# Altium project DM3370.PrjPcb (part 4 of 14)

## Sheet DM3370_LCD_LEDring.SchDoc: =project_title
size Tabloid; PageSetup: Record=PageOptions|CenterHorizontal=True|CenterVertical=True|PrintScale=0.71|XCorrection=1.00|YCorrection=1.00|PrintKind=0|BorderSize=5000000|LeftOffset=0|BottomOffset=0|Orientation=2|PaperLength=1000|PaperWidth=1000|Scale=100|PaperSource=7|PrintQuality=-4|MediaType=1|DitherType=10|PrintScaleMode=1|PaperKind=A4; CompanyName: Luxonis Holding; DrawnBy: David Malovrh; Organization: Luxonis Holding; Address1: 1925 Harmony Park Drive; Address2: Westminster, CO; Address3: 80234; Address4: United States; DocumentNumber: 11; Revision: R5M2E5; SheetNumber: 11; SheetTotal: 17
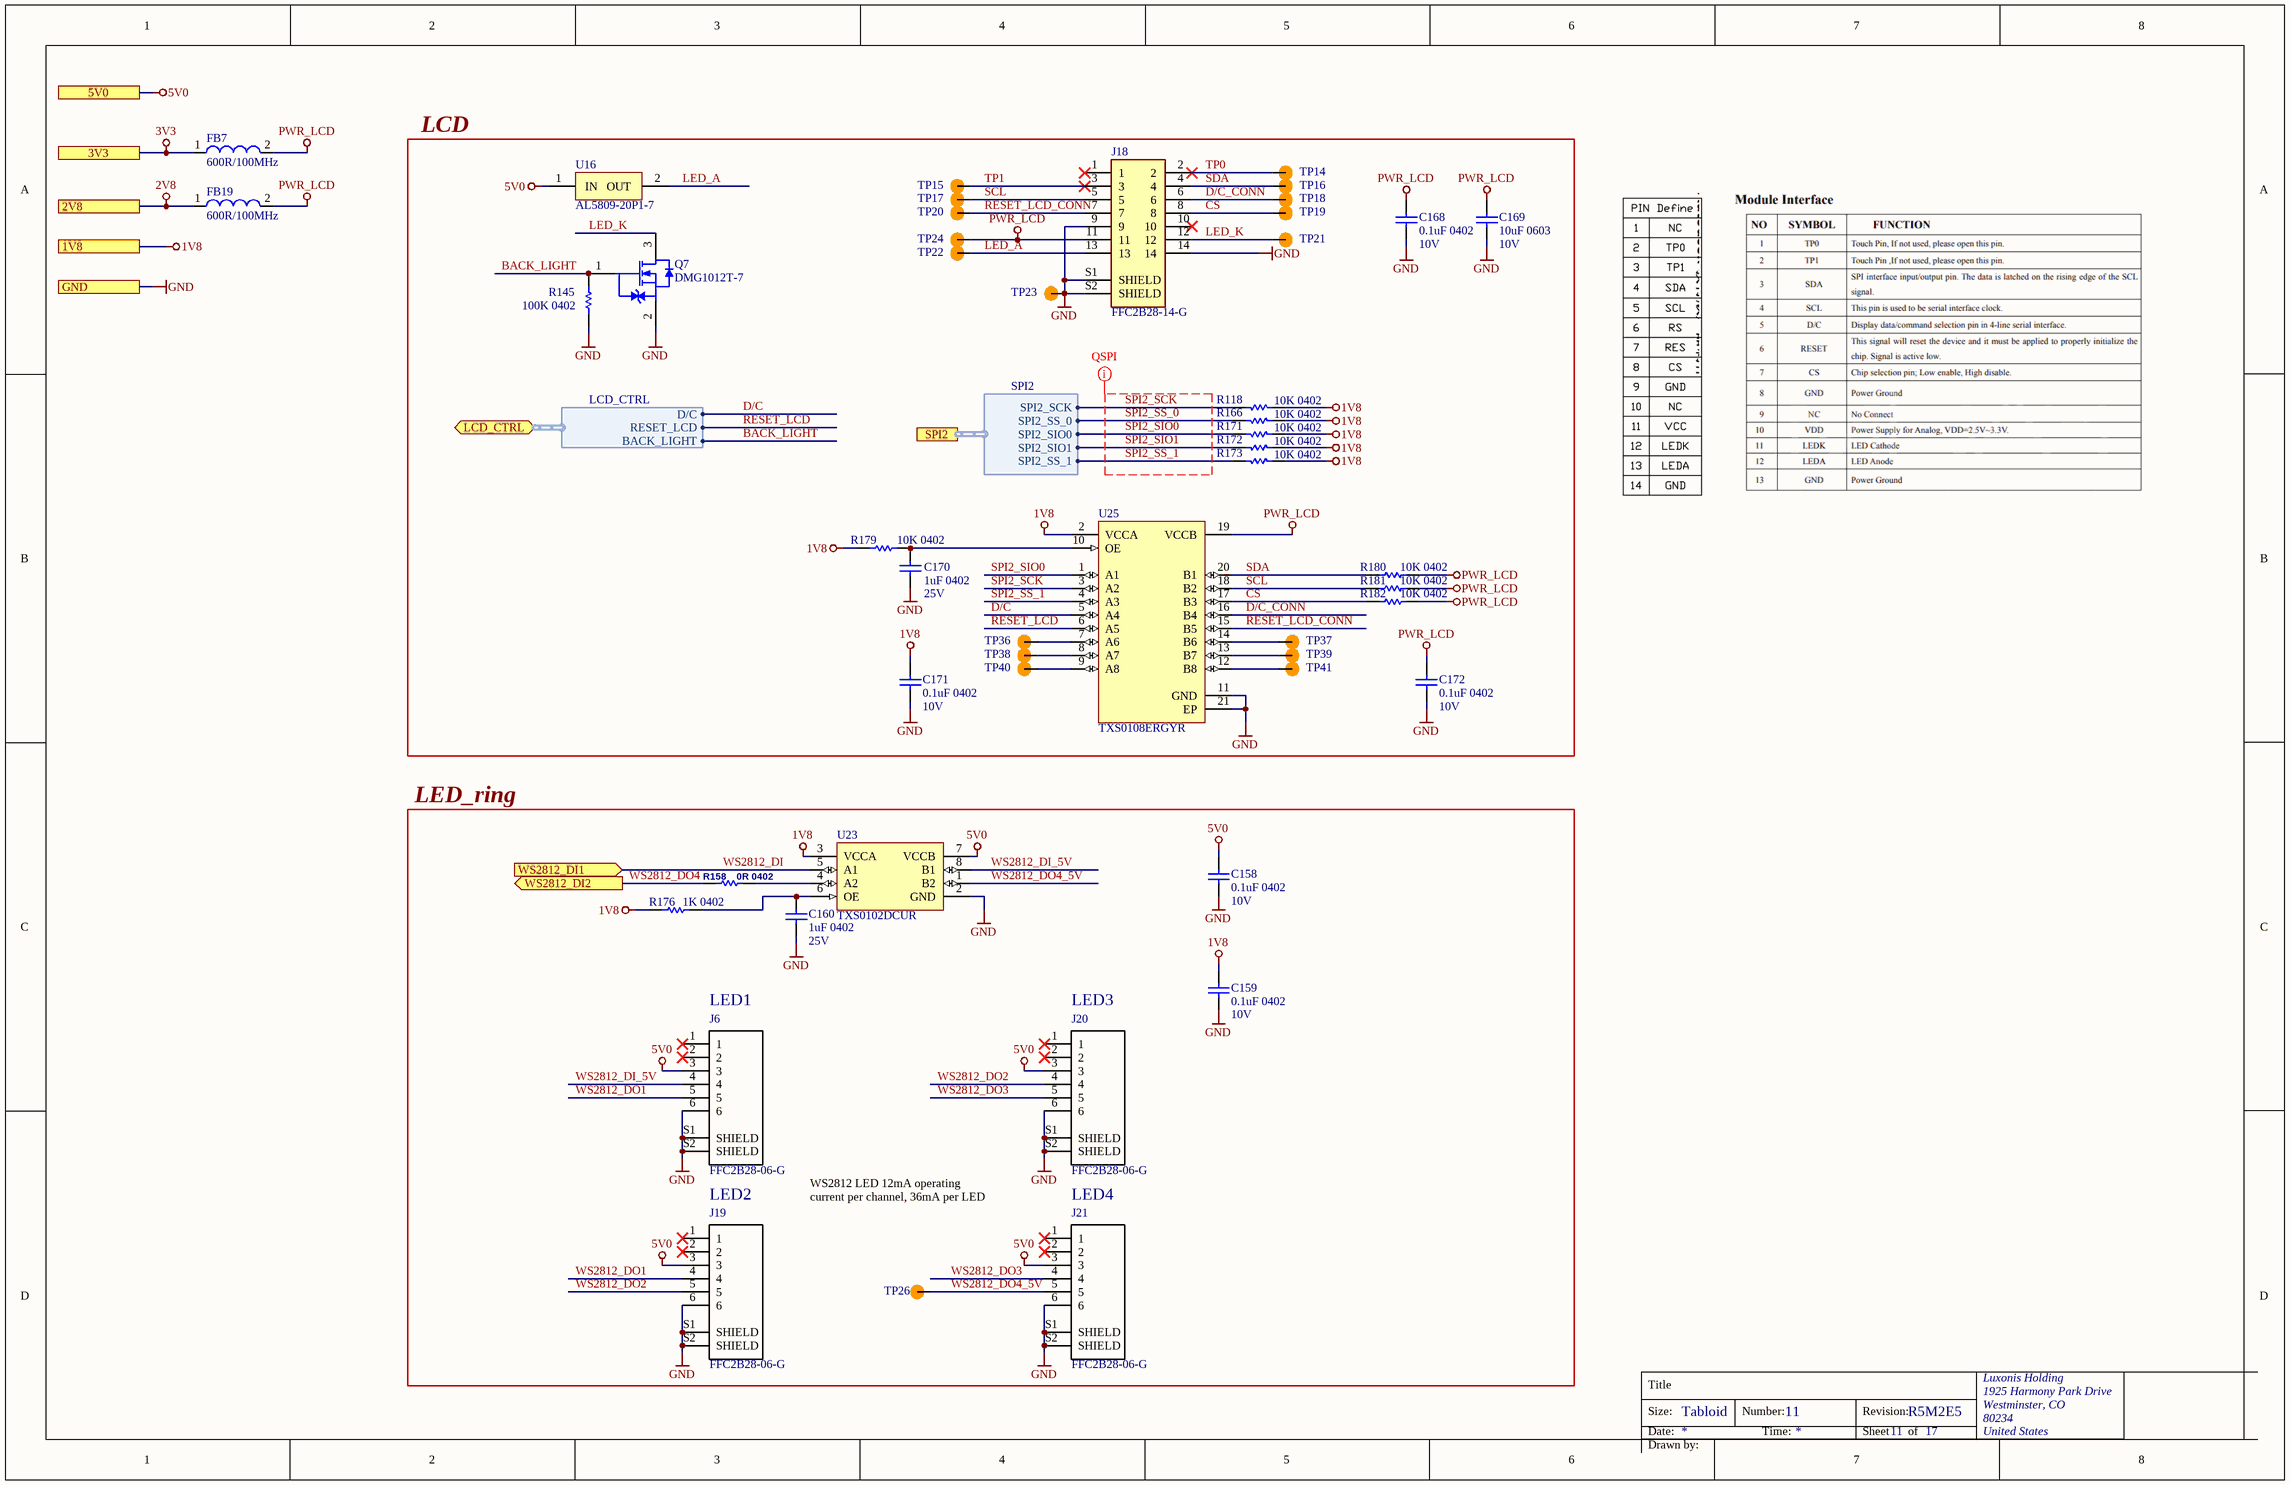
[diagram p7: DM3370_LCD_LEDring.SchDoc]

### Parts
C158  0.1uF 0402  Voltage Rating: 10V  [CAPC0402(1005)70_L]
C159  0.1uF 0402  Voltage Rating: 10V  [CAPC0402(1005)70_L]
C160  1uF 0402  Voltage Rating: 25V  [CAPC0402(1005)70_L]
C168  0.1uF 0402  Voltage Rating: 10V  [CAPC0402(1005)70_L]
C169  10uF 0603  Voltage Rating: 10V  [CAPC0603(1608)100_L]
C170  1uF 0402  Voltage Rating: 25V  [CAPC0402(1005)70_L]
C171  0.1uF 0402  Voltage Rating: 10V  [CAPC0402(1005)70_L]
C172  0.1uF 0402  Voltage Rating: 10V  [CAPC0402(1005)70_L]
FB7  600R/100MHz  [2508056017Y2]
FB19  600R/100MHz  [2508056017Y2]
J6  FFC2B28-06-G  [FFC2B28-06-G]
J18  FFC2B28-14-G  [GCT_FFC2B28-14-G]
J19  FFC2B28-06-G  [FFC2B28-06-G]
J20  FFC2B28-06-G  [FFC2B28-06-G]
J21  FFC2B28-06-G  [FFC2B28-06-G]
Q7  DMG1012T-7  [DMG1012T-7]
R118  10K 0402  [RESC0402(1005)_L]
R145  100K 0402  [RESC0402(1005)_L]
R158  0R 0402  [RESC0402(1005)_L]
R166  10K 0402  [RESC0402(1005)_L]
R171  10K 0402  [RESC0402(1005)_L]
R172  10K 0402  [RESC0402(1005)_L]
R173  10K 0402  [RESC0402(1005)_L]
R176  1K 0402  [RESC0402(1005)_L]
R179  10K 0402  [RESC0402(1005)_L]
R180  10K 0402  [RESC0402(1005)_L]
R181  10K 0402  [RESC0402(1005)_L]
R182  10K 0402  [RESC0402(1005)_L]
TP14  TEST_POINT  [TP075_150_NS]  (value not drawn)  (no BOM)
TP15  TEST_POINT  [TP075_150_NS]  (value not drawn)  (no BOM)
TP16  TEST_POINT  [TP075_150_NS]  (value not drawn)  (no BOM)
TP17  TEST_POINT  [TP075_150_NS]  (value not drawn)  (no BOM)
TP18  TEST_POINT  [TP075_150_NS]  (value not drawn)  (no BOM)
TP19  TEST_POINT  [TP075_150_NS]  (value not drawn)  (no BOM)
TP20  TEST_POINT  [TP075_150_NS]  (value not drawn)  (no BOM)
TP21  TEST_POINT  [TP075_150_NS]  (value not drawn)  (no BOM)
TP22  TEST_POINT  [TP075_150_NS]  (value not drawn)  (no BOM)
TP23  TEST_POINT  [TP075_150_NS]  (value not drawn)  (no BOM)
TP24  TEST_POINT  [TP075_150_NS]  (value not drawn)  (no BOM)
TP26  TEST_POINT  [TP075_150_NS]  (value not drawn)  (no BOM)
TP36  TEST_POINT  [TP075_150_NS]  (value not drawn)  (no BOM)
TP37  TEST_POINT  [TP075_150_NS]  (value not drawn)  (no BOM)
TP38  TEST_POINT  [TP075_150_NS]  (value not drawn)  (no BOM)
TP39  TEST_POINT  [TP075_150_NS]  (value not drawn)  (no BOM)
TP40  TEST_POINT  [TP075_150_NS]  (value not drawn)  (no BOM)
TP41  TEST_POINT  [TP075_150_NS]  (value not drawn)  (no BOM)
U16  AL5809-20P1-7  [DIOD-POWERDI123-2_B_V]
U23  TXS0102DCUR  [TXS0102DCUR]
U25  TXS0108ERGYR  [TXS0108ERGYR]

### Blocks framed on the sheet
LCD: C168-C172 J18 Q7 R118 R145 R166 R171-R173 R179-R182 TP14-TP24 TP36-TP41 U16 U25
LED_ring: C158-C160 J6 J19-J21 R158 R176 TP26 U23

### Ports
1V8, 2V8, 3V3, 5V0, GND, LCD_CTRL (bidir, harness LCD_CTRL), SPI2 (harness SPI2), WS2812_DI1 (in), WS2812_DI2 (out)

### Harnesses
SPI2: SPI2_SCK, SPI2_SS_0, SPI2_SIO0, SPI2_SIO1, SPI2_SS_1
LCD_CTRL: RESET_LCD, D/C, BACK_LIGHT

### Nets
1V8: C159.2 C171.2 R118.1 R166.1 R171.1 R172.1 R173.1 R176.2 R179.2 U23.3(VCCA) U25.2(VCCA) ; port 1V8
2V8: FB19.1 ; port 2V8
3V3: FB7.1 ; port 3V3
5V0: C158.2 J6.3 J19.3 J20.3 J21.3 U16.1(IN) U23.7(VCCB) ; port 5V0
GND: C158.1 C159.1 C160.1 C168.1 C169.1 C170.1 C171.1 C172.1 J6.6 J6.S1(SHIELD) J6.S2(SHIELD) J18.9 J18.14 J18.S1(SHIELD) J18.S2(SHIELD) J19.6 J19.S1(SHIELD) J19.S2(SHIELD) J20.6 J20.S1(SHIELD) J20.S2(SHIELD) J21.6 J21.S1(SHIELD) J21.S2(SHIELD) Q7.2 R145.1 TP23.1 U23.2(GND) U25.11(GND) U25.21(EP) ; port GND
PWR_LCD: C168.2 C169.2 C172.2 FB7.2 FB19.2 J18.11 R180.2 R181.2 R182.2 TP24.1 U25.19(VCCB)
BACK_LIGHT: Q7.1 R145.2 ; port LCD_CTRL.BACK_LIGHT
CS: J18.8 R182.1 TP19.1 U25.17(B3)
D/C: U25.5(A4) ; port LCD_CTRL.D/C
D/C_CONN: J18.6 TP18.1 U25.16(B4)
LED_A: J18.13 TP22.1 U16.2(OUT)
LED_K: J18.12 Q7.3 TP21.1
RESET_LCD: U25.6(A5) ; port LCD_CTRL.RESET_LCD
RESET_LCD_CONN: J18.7 TP20.1 U25.15(B5)
SCL: J18.5 R181.1 TP17.1 U25.18(B2)
SDA: J18.4 R180.1 TP16.1 U25.20(B1)
SPI2_SCK: R118.2 U25.3(A2) ; port SPI2.SPI2_SCK
SPI2_SIO0: R171.2 U25.1(A1) ; port SPI2.SPI2_SIO0
SPI2_SIO1: R172.2 ; port SPI2.SPI2_SIO1
SPI2_SS_0: R166.2 ; port SPI2.SPI2_SS_0
SPI2_SS_1: R173.2 U25.4(A3) ; port SPI2.SPI2_SS_1
TP0: J18.2 TP14.1
TP1: J18.3 TP15.1
WS2812_DI: U23.5(A1) ; port WS2812_DI1
WS2812_DI_5V: J6.4 U23.8(B1)
WS2812_DO1: J6.5 J19.4
WS2812_DO2: J19.5 J20.4
WS2812_DO3: J20.5 J21.4
WS2812_DO4: R158.2 ; port WS2812_DI2
WS2812_DO4_5V: J21.5 TP26.1 U23.1(B2)
NetC160_2: C160.2 R176.1 U23.6(OE)
NetC170_2: C170.2 R179.1 U25.10(OE)
NetR158_1: R158.1 U23.4(A2)
NetTP36_1: TP36.1 U25.7(A6)
NetTP37_1: TP37.1 U25.14(B6)
NetTP38_1: TP38.1 U25.8(A7)
NetTP39_1: TP39.1 U25.13(B7)
NetTP40_1: TP40.1 U25.9(A8)
NetTP41_1: TP41.1 U25.12(B8)

Not connected (* = marked no-connect by the designer): J6 1* 2*; J18 1* 10*; J19 1* 2*; J20 1* 2*; J21 1* 2*

### Layout directives
net class QSPI: SPI2_SCK, SPI2_SIO0, SPI2_SIO1, SPI2_SS_0, SPI2_SS_1

### Notes on the sheet
- (near J6) LED1
- (near J20) LED3
- LED2
- WS2812 LED 12mA operating current per channel, 36mA per LED
- LED4
- Title
- Size:
- Date:
- Tabloid
- Number:
- Time:
- Revision:
- Sheet
- of
- Drawn by:

### Library data of the parts
C158 C159 C168 C171 C172 = GRM155R71A104JA01D: CAP CER 0.1UF 10V X7R 0402 5%; Manufacturer 1: Murata; Capacitance: 100nF; Supplier 1: Digi-Key; Manufacturer Part Number 1: GRM155R71A104JA01D; Stock 1: 1346709; Pricing 1: 1=0.10000, 10=0.02500, 100=0.01130, 500=0.00806, 1000=0.00633, 2500=0.00575, 5000=0.00529 (USD); RoHS: Yes; Mount: Surface Mount; Case/Package: 0402; Case Code (Imperial): 0402; Case Code (Metric): 1005; Min Operating Temperature: -55°C; Max Operating Temperature: 125°C; Tolerance: 5%; Packaging: Tape and Reel; Voltage Rating (DC): 10V; Dielectric: X7R; Package Quantity: 10000; Termination: SMD/SMT; Length: 1mm; Height: 0.5mm; Width: 0.02inch; Thickness: 0.022inch; Depth: 0.5mm; Radiation Hardening: No; Lead Free: Lead Free; ComponentLink1URL: https://datasheet.ciiva.com/5411/product-5411135.pdf?src-supplier=Mouser; ComponentLink1Description: https://datasheet.ciiva.com/5411/product-5411135.pdf?src-supplier=Mouser; ComponentLink2URL: https://datasheet.ciiva.com/11618/c02e-11618821.pdf?src-supplier=Avnet; ComponentLink2Description: https://datasheet.ciiva.com/11618/c02e-11618821.pdf?src-supplier=Avnet; Supplier Part Number 1: 490-10777-1-ND
C160 C170 = GRM155R61E105KA12D: CAP CER 1UF 25V X5R 0402 10%; Manufacturer 1: Murata; Material: Ceramic; Supplier 1: Digi-Key; Manufacturer Part Number 1: GRM155R61E105KA12D; Stock 1: 200653; Pricing 1: 1=0.10000, 10=0.07100, 100=0.03350, 500=0.02352, 1000=0.01947, 2500=0.01812, 5000=0.01658 (USD); RoHS: Yes; Mount: Surface Mount; Case/Package: 0402; Weight: 0.000212oz; Case Code (Metric): 1005; Case Code (Imperial): 0402; Min Operating Temperature: -55°C; Max Operating Temperature: 85°C; Tolerance: 10%; Capacitance: 1uF; Dielectric: X5R; Voltage Rating (DC): 25V; Packaging: Tape and Reel; Package Quantity: 10000; Termination: SMD/SMT; Voltage: 25V; Length: 1mm; Height: 0.5mm; Width: 0.5mm; Thickness: 0.022inch; Depth: 0.5mm; Lead Free: Lead Free; REACH SVHC: No SVHC; ComponentLink1URL: https://datasheet.ciiva.com/22732/1666664-22732122.pdf?src-supplier=Element14; ComponentLink1Description: https://datasheet.ciiva.com/22732/1666664-22732122.pdf?src-supplier=Element14; ComponentLink2URL: https://datasheet.ciiva.com/7719/1666664-7719006.pdf?src-supplier=Element14; ComponentLink2Description: https://datasheet.ciiva.com/7719/1666664-7719006.pdf?src-supplier=Element14; Supplier Part Number 1: 490-10017-1-ND; Supplier 2: Arrow; Supplier 3: TTI; Supplier Part Number 2: GRM155R61E105KA12D; Supplier Part Number 3: GRM155R61E105KA12D
C169 = GRM188R61A106ME69D: CAP CER 10UF 10V X5R 0603 20%; Manufacturer 1: Murata; Material: Ceramic; Manufacturer Part Number 1: GRM188R61A106ME69D; Supplier 1: Digi-Key; Stock 1: 2873098; Pricing 1: 1=0.21000, 10=0.14100, 100=0.07130, 500=0.04876, 1000=0.04313 (USD); RoHS: Yes; Mount: Surface Mount; Case/Package: 0603; Weight: 0.000222oz; Case Code (Metric): 1608; Case Code (Imperial): 0603; Min Operating Temperature: -55°C; Max Operating Temperature: 85°C; Packaging: Tape and Reel; Tolerance: 20%; Capacitance: 10uF; Dielectric: X5R; Voltage Rating (DC): 10V; Package Quantity: 4000; Termination: SMD/SMT; Length: 1.6mm; Height: 0.8mm; Width: 0.8mm; Thickness: 0.035inch; Depth: 0.8mm; REACH SVHC: Unknown; Lead Free: Lead Free; ComponentLink1URL: http://www.mouser.com/ds/2/281/c02e-2905.pdf?src-supplier=Mouser; ComponentLink1Description: http://www.mouser.com/ds/2/281/c02e-2905.pdf?src-supplier=Mouser; ComponentLink2URL: http://components.arrow.com/part/dataview/0323_06119472?src-supplier=Arrow+Europe; ComponentLink2Description: http://components.arrow.com/part/dataview/0323_06119472?src-supplier=Arrow+Europe; ComponentLink3URL: http://www.farnell.com/datasheets/2048014.pdf?src-supplier=Farnell; ComponentLink3Description: http://www.farnell.com/datasheets/2048014.pdf?src-supplier=Farnell; ComponentLink4URL: http://www.farnell.com/datasheets/1872210.pdf?src-supplier=Farnell; ComponentLink4Description: http://www.farnell.com/datasheets/1872210.pdf?src-supplier=Farnell; ComponentLink5URL: http://search.murata.co.jp/Ceramy/image/img/A01X/G101/ENG/GRM188R61A106ME69-01.pdf?src-supplier=Digi-Key; ComponentLink5Description: http://search.murata.co.jp/Ceramy/image/img/A01X/G101/ENG/GRM188R61A106ME69-01.pdf?src-supplier=Digi-Key; ComponentLink6URL: http://www.farnell.com/datasheets/1872210.pdf?src-supplier=Newark; ComponentLink6Description: http://www.farnell.com/datasheets/1872210.pdf?src-supplier=Newark; ComponentLink7URL: http://www.farnell.com/datasheets/2048014.pdf?src-supplier=Element14; ComponentLink7Description: http://www.farnell.com/datasheets/2048014.pdf?src-supplier=Element14; ComponentLink8URL: http://www.farnell.com/datasheets/2048014.pdf?src-supplier=Newark; ComponentLink8Description: http://www.farnell.com/datasheets/2048014.pdf?src-supplier=Newark; Supplier Part Number 1: 490-10475-1-ND
FB7 FB19 = 2508056017Y2: FERRITE BEAD, 0.1OHM, 2A, 0805, 600R/100MHz; Manufacturer 1: Fair-Rite; Impedance: 600R; Tolerance: 25%; Resistance: 350mR; DC Resistance (DCR): 100mR; Test Frequency: 100MHz; Manufacturer Part Number 1: 2508056017Y2; Supplier 1: Digi-Key; Stock 1: 100491; Pricing 1: 1=0.10000, 10=0.07900, 25=0.07120, 50=0.05240, 100=0.04520, 250=0.03568, 500=0.03014, 1000=0.02538 (USD); RoHS: Yes; Case/Package: 0805; Number of Pins: 2; Case Code (Metric): 2012; Case Code (Imperial): 0805; Min Operating Temperature: -55°C; Max Operating Temperature: 125°C; Package Quantity: 4000; Packaging: Tape and Reel; Max DC Current: 2A; Termination: SMD/SMT; Military Standard: Not; DC Current: 2A; Current Rating: 2A; Frequency: 100MHz; Length: 2mm; Height: 0.9mm; Width: 1.25mm; Depth: 1.25mm; Radiation Hardening: No; REACH SVHC: No SVHC; ComponentLink1URL: https://datasheet.ciiva.com/3854/3802508056017y2-3854245.pdf?src-supplier=Arrow; ComponentLink1Description: https://datasheet.ciiva.com/3854/3802508056017y2-3854245.pdf?src-supplier=Arrow; ComponentLink2URL: https://datasheet.ciiva.com/22735/652149-22735047.pdf?src-supplier=Element14; ComponentLink2Description: https://datasheet.ciiva.com/22735/652149-22735047.pdf?src-supplier=Element14; ComponentLink3URL: https://datasheet.ciiva.com/1127/26143-1127514.pdf?src-supplier=Farnell; ComponentLink3Description: https://datasheet.ciiva.com/1127/26143-1127514.pdf?src-supplier=Farnell; ComponentLink4URL: https://datasheet.ciiva.com/18090/getdatasheetpartid-212640-18090187.pdf?src-supplier=Verical; ComponentLink4Description: https://datasheet.ciiva.com/18090/getdatasheetpartid-212640-18090187.pdf?src-supplier=Verical; ComponentLink5URL: https://datasheet.ciiva.com/7620/26143-7620140.pdf?src-supplier=Element14; ComponentLink5Description: https://datasheet.ciiva.com/7620/26143-7620140.pdf?src-supplier=Element14; Supplier Part Number 1: 1934-1487-1-ND
J6 J19-J21 = CMP-002-00152-1: Connector, Ffc, R/a Rcpt, 6POS, 1ROW, 0.5MM;; Manufacturer 1: Global Connector Technology; Gender: Female; Design Item ID: FFC2B28-06-G; Pins: 6; Availability: Unavailable; Manufacturer Part Number 1: FFC2B28-06-G; Component Type: Standard
J18 = CMP-002-00095-3: 14W, 0.5mm FFC Con, R/A, Dual Cont, B/Flp, H1.0mm, Gld, SMT, T&R; Manufacturer 1: GCT; Manufacturer Part Number 1: FFC2B28-14-G
Q7 = CMP-016-000009-1: MOSFET N-CH 20V 630MA SOT-523; Manufacturer 1: Diodes; Number of Channels: 1; Drain to Source Resistance: 300mR; Rds On Max: 400mR; Element Configuration: Single; Turn-Off Delay Time: 26.7ns; Turn-On Delay Time: 5.1ns; Rise Time: 7.4ns; Gate to Source Voltage (Vgs): 6V; Power Dissipation: 280mW; Threshold Voltage: 1V; FET Type: 1 N-Channel; Input Capacitance: 60.67pF; Fall Time: 12.3ns; Case/Package: SOT-523; ComponentLink4Description: https://datasheet.ciiva.com/17324/ds31783-17324010.pdf?src-supplier=Avnet+Europe; Number of Pins: 3; ComponentLink5URL: https://datasheet.ciiva.com/6383/ds31783-6383803.pdf?src-supplier=Digi-Key; ComponentLink1URL: https://datasheet.ciiva.com/934/ds31783-934512.pdf?src-supplier=Digi-Key; Design Item ID: DMG1012T-7; Height: 0.8mm; Pricing 1: 1=0.30000, 10=0.24600, 100=0.10070, 500=0.08396, 1000=0.05834 (USD); Mount: Surface Mount; Lead Free: Lead Free; ComponentLink3Description: https://datasheet.ciiva.com/11174/ds31783-11174965.pdf?src-supplier=Avnet; Max Operating Temperature: 150°C; ComponentLink6Description: https://datasheet.ciiva.com/934/ds31783-934511.pdf?src-supplier=Digi-Key; ComponentLink3URL: https://datasheet.ciiva.com/11174/ds31783-11174965.pdf?src-supplier=Avnet; On-State Resistance: 400MR; Stock 1: 1268946; Source: LuxonisMaster.SchLib; ComponentLink2Description: https://datasheet.ciiva.com/4442/ds31783-44973-4442944.pdf?src-supplier=Mouser; ComponentLink4URL: https://datasheet.ciiva.com/17324/ds31783-17324010.pdf?src-supplier=Avnet+Europe; ComponentLink1Description: https://datasheet.ciiva.com/934/ds31783-934512.pdf?src-supplier=Digi-Key; ComponentLink6URL: https://datasheet.ciiva.com/934/ds31783-934511.pdf?src-supplier=Digi-Key; Min Operating Temperature: -55°C; Manufacturer Part Number 1: DMG1012T-7; REACH SVHC: No SVHC; Drain to Source Voltage (Vdss): 20V; Length: 1.7mm; RoHS: Yes; Weight: 7.1E-05oz; Width: 0.85mm; Radiation Hardening: No; Packaging: Tape and Reel; ComponentLink5Description: https://datasheet.ciiva.com/6383/ds31783-6383803.pdf?src-supplier=Digi-Key; Contact Plating: Tin,Matte; Max Power Dissipation: 280mW; Package Quantity: 3000; Drain to Source Breakdown Voltage: 20V; Continuous Drain Current (ID): 630mA; Number of Elements: 1; ComponentLink2URL: https://datasheet.ciiva.com/4442/ds31783-44973-4442944.pdf?src-supplier=Mouser
R118 R166 R171-R173 R179-R182 = RC0402FR-1310KL: RES SMD 10K OHM 1% 0402 1/16W Chip Resistor, 0402 [1005 Metric], 10 kohm, RC Series, 50 V, Thick Film, 62.5 mW; Manufacturer 1: Yageo; Resistance: 10kR; Temperature Coefficient: 100ppm/°C; Power Rating: 62.5mW; Voltage Rating: 50V; ComponentLink1URL: https://datasheet.ciiva.com/16940/pyu-rc0402-51-rohs-l-6-16940293.pdf?src-supplier=Avnet+Europe; ComponentLink1Description: https://datasheet.ciiva.com/16940/pyu-rc0402-51-rohs-l-6-16940293.pdf?src-supplier=Avnet+Europe; ComponentLink2URL: https://datasheet.ciiva.com/28386/pyu-rc0402-51-rohs-l-6-28386855.pdf?src-supplier=Avnet+Europe; ComponentLink2Description: https://datasheet.ciiva.com/28386/pyu-rc0402-51-rohs-l-6-28386855.pdf?src-supplier=Avnet+Europe; ComponentLink3URL: https://datasheet.ciiva.com/16740/pyu-rc0402-51-rohs-l-6-r-16740602.pdf?src-supplier=Future+Electronics; ComponentLink3Description: https://datasheet.ciiva.com/16740/pyu-rc0402-51-rohs-l-6-r-16740602.pdf?src-supplier=Future+Electronics; ComponentLink4URL: https://datasheet.ciiva.com/8891/pyu-rc0402-51-rohs-l-6-8891339.pdf?src-supplier=Avnet; ComponentLink4Description: https://datasheet.ciiva.com/8891/pyu-rc0402-51-rohs-l-6-8891339.pdf?src-supplier=Avnet; ComponentLink5URL: https://datasheet.ciiva.com/5557/pyu-rc0402-51-rohs-l-6-r-5557997.pdf?src-supplier=Mouser; ComponentLink5Description: https://datasheet.ciiva.com/5557/pyu-rc0402-51-rohs-l-6-r-5557997.pdf?src-supplier=Mouser; ComponentLink6URL: https://datasheet.ciiva.com/7983/1018594-7983533.pdf?src-supplier=Element14; ComponentLink6Description: https://datasheet.ciiva.com/7983/1018594-7983533.pdf?src-supplier=Element14; Supplier 1: Newark; Manufacturer Part Number 1: RC0402FR-1310KL; Stock 1: 62239; Pricing 1: 1=0.10000, 25=0.01200, 100=0.00400, 250=0.00400, 500=0.00300, 1000=0.00300 (USD); RoHS: Yes; Case/Package: 0402; Number of Pins: 2; Contact Plating: Tin,Matte,Lead; Case Code (Imperial): 0402; Case Code (Metric): 1005; Min Operating Temperature: -55°C; Max Operating Temperature: 155°C; Tolerance: 1%; Composition: Thick Film; Packaging: Tape and Reel; Termination: SMD/SMT; Military Standard: Not; Voltage Rating (DC): 50V; Working Voltage: 50V; Number of Terminations: 2; Length: 1mm; Depth: 0.5mm; Radiation Hardening: No; REACH SVHC: No SVHC; Lead Free: Lead Free; Supplier Part Number 1: 67R9960; Supplier 2: Future Electronics; Supplier 3: Mouser; Supplier 4: Element14; Supplier Part Number 2: RC0402FR-1310KL-CUTT; Supplier Part Number 3: 603-RC0402FR-1310KL; Supplier Part Number 4: 1799235
R145 = RC0402FR-07100KL: RES SMD 100K OHM 1% 1/16W 0402; Manufacturer 1: Yageo; Power Rating: 63mW; Resistance: 100kR; Temperature Coefficient: 100ppm/°C; Voltage Rating: 50V; Supplier 1: Digi-Key; Manufacturer Part Number 1: RC0402FR-07100KL; Stock 1: 50867324; Pricing 1: 1=0.10000, 10=0.01500, 100=0.00600, 1000=0.00270, 2500=0.00235, 5000=0.00194 (USD); RoHS: Yes; Case/Package: 0402; Case Code (Metric): 1005; Case Code (Imperial): 0402; Min Operating Temperature: -55°C; Max Operating Temperature: 155°C; Tolerance: 1%; Packaging: Tape and Reel; Composition: Thick Film; Termination: SMD/SMT; Military Standard: Not; Package Quantity: 1; Number of Terminations: 2; Max Power Dissipation: 63mW; Features: Moisture Resistant; Working Voltage: 50V; Length: 0.039inch; Height: 0.016inch; Width: 0.02inch; Depth: 0.5mm; Lead Free: Lead Free; REACH SVHC: No SVHC; ComponentLink1URL: https://datasheet.ciiva.com/11819/0900766b80c66297-11819452.pdf?src-supplier=RSComponents; ComponentLink1Description: https://datasheet.ciiva.com/11819/0900766b80c66297-11819452.pdf?src-supplier=RSComponents; ComponentLink2URL: https://datasheet.ciiva.com/2453/pyu-r-int-thick-7-2453361.pdf?src-supplier=Digi-Key; ComponentLink2Description: https://datasheet.ciiva.com/2453/pyu-r-int-thick-7-2453361.pdf?src-supplier=Digi-Key; ComponentLink3URL: https://datasheet.ciiva.com/2453/pyu-r-int-thick-7-2453362.pdf?src-supplier=Digi-Key; ComponentLink3Description: https://datasheet.ciiva.com/2453/pyu-r-int-thick-7-2453362.pdf?src-supplier=Digi-Key; ComponentLink4URL: https://datasheet.ciiva.com/2453/pyu-r-int-thick-7-2453363.pdf?src-supplier=Digi-Key; ComponentLink4Description: https://datasheet.ciiva.com/2453/pyu-r-int-thick-7-2453363.pdf?src-supplier=Digi-Key; ComponentLink5URL: https://datasheet.ciiva.com/22747/1018594-22747509.pdf?src-supplier=Element14; ComponentLink5Description: https://datasheet.ciiva.com/22747/1018594-22747509.pdf?src-supplier=Element14; ComponentLink6URL: https://datasheet.ciiva.com/15189/getdatasheetpartid-323696-15189334.pdf?src-supplier=Verical; ComponentLink6Description: https://datasheet.ciiva.com/15189/getdatasheetpartid-323696-15189334.pdf?src-supplier=Verical; ComponentLink7URL: https://datasheet.ciiva.com/12667/pyu-rc0402-51-rohs-l-6-r-12667930.pdf?src-supplier=Mouser; ComponentLink7Description: https://datasheet.ciiva.com/12667/pyu-rc0402-51-rohs-l-6-r-12667930.pdf?src-supplier=Mouser; Supplier 2: Newark; Supplier 3: Mouser; Supplier Part Number 1: 311-100KLRCT-ND; Supplier Part Number 2: 67R9887; Supplier Part Number 3: 603-RC0402FR-07100KL
R158 = CRCW04020000Z0ED: RES SMD 0 OHM JUMPER 1/16W 0402; Manufacturer 1: Vishay; Resistance: 0mR; Power Rating: 63mW; Voltage Rating: 50V; Temperature Coefficient: 100ppm/°C; Tolerance: 5%; Supplier 1: Digi-Key; Manufacturer Part Number 1: CRCW04020000Z0ED; Stock 1: 855968; Pricing 1: 1=0.10000, 10=0.03400, 25=0.02440, 50=0.01860, 100=0.01380, 250=0.01048, 500=0.00840, 1000=0.00618, 5000=0.00443 (USD); RoHS: Yes; Mount: Surface Mount; Case/Package: 0402; Weight: 2.3E-05oz; Case Code (Imperial): 0402; Case Code (Metric): 1005; Contact Plating: Tin; Min Operating Temperature: -55°C; Max Operating Temperature: 155°C; Packaging: Tape and Reel; Composition: Thick Film; Voltage Rating (DC): 50V; Package Quantity: 1; Termination: SMD/SMT; Number of Terminations: 2; Military Standard: Not; Max Power Dissipation: 63mW; Features: Automotive AEC-Q200; Length: 1mm; Height: 0.35mm; Width: 0.5mm; Depth: 0.5mm; Radiation Hardening: No; REACH SVHC: Unknown; Lead Free: Lead Free; ComponentLink1URL: https://datasheet.ciiva.com/3255/dcrcwe3-3255944.pdf?src-supplier=Avnet; ComponentLink1Description: https://datasheet.ciiva.com/3255/dcrcwe3-3255944.pdf?src-supplier=Avnet; ComponentLink2URL: https://datasheet.ciiva.com/3255/dcrcwe3-3255945.pdf?src-supplier=Avnet; ComponentLink2Description: https://datasheet.ciiva.com/3255/dcrcwe3-3255945.pdf?src-supplier=Avnet; ComponentLink3URL: https://datasheet.ciiva.com/16881/dcrcwe3-16881413.pdf?src-supplier=Avnet+Europe; ComponentLink3Description: https://datasheet.ciiva.com/16881/dcrcwe3-16881413.pdf?src-supplier=Avnet+Europe; ComponentLink4URL: https://datasheet.ciiva.com/2461/dcrcwe3-2461962.pdf?src-supplier=Digi-Key; ComponentLink4Description: https://datasheet.ciiva.com/2461/dcrcwe3-2461962.pdf?src-supplier=Digi-Key; ComponentLink5URL: https://datasheet.ciiva.com/7841/1720486-7841802.pdf?src-supplier=Element14; ComponentLink5Description: https://datasheet.ciiva.com/7841/1720486-7841802.pdf?src-supplier=Element14; ComponentLink6URL: https://datasheet.ciiva.com/2461/dcrcwe3-2461963.pdf?src-supplier=Digi-Key; ComponentLink6Description: https://datasheet.ciiva.com/2461/dcrcwe3-2461963.pdf?src-supplier=Digi-Key; ComponentLink7URL: https://datasheet.ciiva.com/2461/dcrcwe3-2461964.pdf?src-supplier=Digi-Key; ComponentLink7Description: https://datasheet.ciiva.com/2461/dcrcwe3-2461964.pdf?src-supplier=Digi-Key; ComponentLink8URL: https://datasheet.ciiva.com/7841/1697337-7841468.pdf?src-supplier=Element14; ComponentLink8Description: https://datasheet.ciiva.com/7841/1697337-7841468.pdf?src-supplier=Element14; ComponentLink9URL: https://datasheet.ciiva.com/16761/70200976-16761309.pdf?src-supplier=Allied+Electronics; ComponentLink9Description: https://datasheet.ciiva.com/16761/70200976-16761309.pdf?src-supplier=Allied+Electronics; ComponentLink10URL: https://datasheet.ciiva.com/26311/fld-crcw-e3-data-en-26311550.pdf?src-supplier=Distrelec; ComponentLink10Description: https://datasheet.ciiva.com/26311/fld-crcw-e3-data-en-26311550.pdf?src-supplier=Distrelec; Supplier Part Number 1: 541-0.0JCT-ND
R176 = RC0402FR-071KL: RES SMD 1K OHM 1% 1/16W 0402 1 kOhms ±1% 0.063W, 1/16W Chip Resistor 0402 (1005 Metric) Moisture Resistant Thick Film; Manufacturer 1: Yageo; Temperature Coefficient: 100ppm/°C; Power Rating: 62.5mW; Voltage Rating (DC): 50V; Resistance: 1kR; RoHS: Yes; Number of Pins: 2; Case Code (Imperial): 0402; Case Code (Metric): 1005; Min Operating Temperature: -55°C; Max Operating Temperature: 155°C; Packaging: Tape and Reel; Composition: Thick Film; Voltage Rating: 50V; Military Standard: Not; Termination: SMD/SMT; Length: 1mm; Height: 0.32mm; Width: 0.5mm; Depth: 0.5mm; Lead Free: Lead Free; REACH SVHC: Unknown; ComponentLink1URL: https://datasheet.ciiva.com/11819/0900766b80c66297-11819477.pdf?src-supplier=RSComponents; ComponentLink1Description: https://datasheet.ciiva.com/11819/0900766b80c66297-11819477.pdf?src-supplier=RSComponents; ComponentLink2URL: https://datasheet.ciiva.com/12666/pyu-rc0402-51-rohs-l-6-r-12666741.pdf?src-supplier=Mouser; ComponentLink2Description: https://datasheet.ciiva.com/12666/pyu-rc0402-51-rohs-l-6-r-12666741.pdf?src-supplier=Mouser; ComponentLink3URL: https://datasheet.ciiva.com/17063/pyu-rc0402-51-rohs-l-6-r-17063193.pdf?src-supplier=Future+Electronics; ComponentLink3Description: https://datasheet.ciiva.com/17063/pyu-rc0402-51-rohs-l-6-r-17063193.pdf?src-supplier=Future+Electronics; ComponentLink4URL: https://datasheet.ciiva.com/22747/1018594-22747513.pdf?src-supplier=Element14; ComponentLink4Description: https://datasheet.ciiva.com/22747/1018594-22747513.pdf?src-supplier=Element14; ComponentLink5URL: https://datasheet.ciiva.com/7849/1018594-7849869.pdf?src-supplier=Element14; ComponentLink5Description: https://datasheet.ciiva.com/7849/1018594-7849869.pdf?src-supplier=Element14; ComponentLink6URL: https://datasheet.ciiva.com/7983/1018594-7983502.pdf?src-supplier=Element14; ComponentLink6Description: https://datasheet.ciiva.com/7983/1018594-7983502.pdf?src-supplier=Element14; ComponentLink7URL: https://datasheet.ciiva.com/7849/1018594-7849871.pdf?src-supplier=Element14; ComponentLink7Description: https://datasheet.ciiva.com/7849/1018594-7849871.pdf?src-supplier=Element14; Supplier 1: Digi-Key; Manufacturer Part Number 1: RC0402FR-071KL; Stock 1: 60695854; Pricing 1: 1=0.10000, 10=0.01600, 100=0.00670, 1000=0.00301, 2500=0.00261, 5000=0.00215 (USD); Case/Package: 0402; Tolerance: 1%; Supplier Part Number 1: 311-1.00KLRCT-ND
TP14-TP24 TP26 TP36-TP41 = CMP-015-000000-1: Design Item ID: TEST_POINT; Source: LuxonisMaster.SchLib
U16 = CMP-007-00037-1: Two Terminal Constant Current LED Driver PowerDI, 2.5V to 60V, -40 °C to 125 °C; Manufacturer 1: Diodes; Dimming: PWM; Number of Outputs: 1; Output Current per Channel: 20mA; RoHS Compliant: Yes; Min Operating Temperature: -40°C; Packaging: Cut Tape; Max Supply Voltage: 60V; Manufacturer Part Number 1: AL5809-20P1-7; Max Operating Temperature: 125°C; Output Voltage: 60V; Mount: Surface Mount; Series: -
U23 = CMP-113-000005-1: TEXAS INSTRUMENTS - TXS0102DCUR - IC, TRANSLATOR, 2 BIT, BI, US-8; Turn-On Delay Time: 260ns; Max Supply Voltage: 5.5V; Min Supply Voltage: 1.65V; Output Current: 1A; Propagation Delay: 4.6ns; Nominal Supply Current: 14.4uA; High Level Output Current: -20uA; Number of Inputs: 2; Output Type: Voltage; Data Rate: 24Mbps; Low Level Output Current: 1mA; Packaging: Tape and Reel; ComponentLink9URL: https://datasheet.ciiva.com/14287/txs0102-14287518.pdf?src-supplier=Avnet; Min Operating Temperature: -40°C; Max Operating Temperature: 85°C; Radiation Hardening: No; Category: Logic Gates; Lead Free: Lead Free; ComponentLink5Description: https://datasheet.ciiva.com/1899/txs0102-1899369.pdf?src-supplier=Digi-Key; ComponentLink4Description: https://datasheet.ciiva.com/1899/txs0102-1899368.pdf?src-supplier=Digi-Key; Design Item ID: TXS0102DCUR; ComponentLink8URL: https://datasheet.ciiva.com/28499/1863639-28499676.pdf?src-supplier=Element14; Number of Pins: 8; Package Quantity: 1; Pricing 1: 1=0.75000, 10=0.65900, 25=0.61960, 100=0.50550, 250=0.46956, 500=0.39964, 1000=0.31971 (USD); Source: BW2098POE_1.SCHLIB; ComponentLink2Description: https://datasheet.ciiva.com/22653/1846850-22653373.pdf?src-supplier=Farnell; ComponentLink10URL: https://datasheet.ciiva.com/46395/1863639-46395871.pdf?src-supplier=Element14; ComponentLink10Description: https://datasheet.ciiva.com/46395/1863639-46395871.pdf?src-supplier=Element14; ComponentLink2URL: https://datasheet.ciiva.com/22653/1846850-22653373.pdf?src-supplier=Farnell; ComponentLink4URL: https://datasheet.ciiva.com/1899/txs0102-1899368.pdf?src-supplier=Digi-Key; ComponentLink1URL: https://datasheet.ciiva.com/15096/getdatasheetpartid-118249-15096172.pdf?src-supplier=Verical; ComponentLink6URL: https://datasheet.ciiva.com/1899/txs0102-1899370.pdf?src-supplier=Digi-Key; Weight: 0.000339oz; Number of Channels: 2; ComponentLink5URL: https://datasheet.ciiva.com/1899/txs0102-1899369.pdf?src-supplier=Digi-Key; Quiescent Current: 14.4uA; ComponentLink3URL: https://datasheet.ciiva.com/1508/1857232-1508821.pdf?src-supplier=Element14; Manufacturer 1: Texas Instruments; ComponentLink7URL: https://datasheet.ciiva.com/14287/txs0102-14287516.pdf?src-supplier=Avnet; ComponentLink7Description: https://datasheet.ciiva.com/14287/txs0102-14287516.pdf?src-supplier=Avnet; Manufacturer Part Number 1: TXS0102DCUR; ComponentLink3Description: https://datasheet.ciiva.com/1508/1857232-1508821.pdf?src-supplier=Element14; Logic Function: Translator; ComponentLink9Description: https://datasheet.ciiva.com/14287/txs0102-14287518.pdf?src-supplier=Avnet; Case/Package: VSSOP; RoHS: Yes; ComponentLink8Description: https://datasheet.ciiva.com/28499/1863639-28499676.pdf?src-supplier=Element14; ComponentLink1Description: https://datasheet.ciiva.com/15096/getdatasheetpartid-118249-15096172.pdf?src-supplier=Verical; ComponentLink6Description: https://datasheet.ciiva.com/1899/txs0102-1899370.pdf?src-supplier=Digi-Key; Stock 1: 55123; Number of Bits: 2; REACH SVHC: No SVHC
U25 = CMP-031-00032-1: IC TRNSLTR BIDIRECTIONAL 20VQFN; Manufacturer 1: Texas Instruments; Propagation Delay: 4.8ns; Max Supply Voltage: 5.5V; Output Type: Voltage; Number of Bits: 8; Data Rate: 60Mbps; Logic Function: Translator; Quiescent Current: 3uA; High Level Output Current: -50mA; Turn-On Delay Time: 312ns; Min Supply Voltage: 1.2V; Low Level Output Current: 50mA; Case/Package: VQFN; Mount: Surface Mount; Design Item ID: TXS0108ERGYR; Lead Free: Lead Free; Source: LuxonisMaster.SchLib; ComponentLink5Description: https://datasheet.ciiva.com/1899/txs0108e-1899610.pdf?src-supplier=Digi-Key; ComponentLink6Description: https://datasheet.ciiva.com/1899/txs0108e-1899611.pdf?src-supplier=Digi-Key; Category: Integrated Circuits (ICs); Manufacturer Part Number 1: TXS0108ERGYR; ComponentLink7URL: https://datasheet.ciiva.com/1899/txs0108e-1899612.pdf?src-supplier=Digi-Key; Min Operating Temperature: -40°C; ComponentLink1Description: https://datasheet.ciiva.com/15096/getdatasheetpartid-189651-15096225.pdf?src-supplier=Verical; ComponentLink9Description: https://datasheet.ciiva.com/48701/001073880-da-01-en-ic-xlatr-volt-lv-txs0108ergyr-qfn-20-tid-48701964.pdf?src-supplier=Conrad; RoHS: Yes; Packaging: Tape and Reel; Number of Inputs: 8; ComponentLink8URL: https://datasheet.ciiva.com/14287/txs0108e-14287533.pdf?src-supplier=Avnet; Package Quantity: 1; Pricing 1: 1=1.42000, 10=1.26600, 25=1.20120, 100=0.98670, 250=0.92236, 500=0.81510, 1000=0.64350 (USD); Radiation Hardening: No; ComponentLink3Description: https://datasheet.ciiva.com/26185/txs0108e-26185177.pdf?src-supplier=Avnet+Europe; ComponentLink3URL: https://datasheet.ciiva.com/26185/txs0108e-26185177.pdf?src-supplier=Avnet+Europe; ComponentLink8Description: https://datasheet.ciiva.com/14287/txs0108e-14287533.pdf?src-supplier=Avnet; ComponentLink6URL: https://datasheet.ciiva.com/1899/txs0108e-1899611.pdf?src-supplier=Digi-Key; REACH SVHC: No SVHC; Number of Channels: 8; Max Operating Temperature: 85°C; Weight: 0.001517oz; ComponentLink4URL: https://datasheet.ciiva.com/14287/txs0108e-14287692.pdf?src-supplier=Avnet; ComponentLink2URL: https://datasheet.ciiva.com/22659/1718976-22659572.pdf?src-supplier=Element14; ComponentLink7Description: https://datasheet.ciiva.com/1899/txs0108e-1899612.pdf?src-supplier=Digi-Key; Pins: 20; ComponentLink2Description: https://datasheet.ciiva.com/22659/1718976-22659572.pdf?src-supplier=Element14; Stock 1: 122729; ComponentLink1URL: https://datasheet.ciiva.com/15096/getdatasheetpartid-189651-15096225.pdf?src-supplier=Verical; ComponentLink9URL: https://datasheet.ciiva.com/48701/001073880-da-01-en-ic-xlatr-volt-lv-txs0108ergyr-qfn-20-tid-48701964.pdf?src-supplier=Conrad; ComponentLink4Description: https://datasheet.ciiva.com/14287/txs0108e-14287692.pdf?src-supplier=Avnet; ComponentLink5URL: https://datasheet.ciiva.com/1899/txs0108e-1899610.pdf?src-supplier=Digi-Key